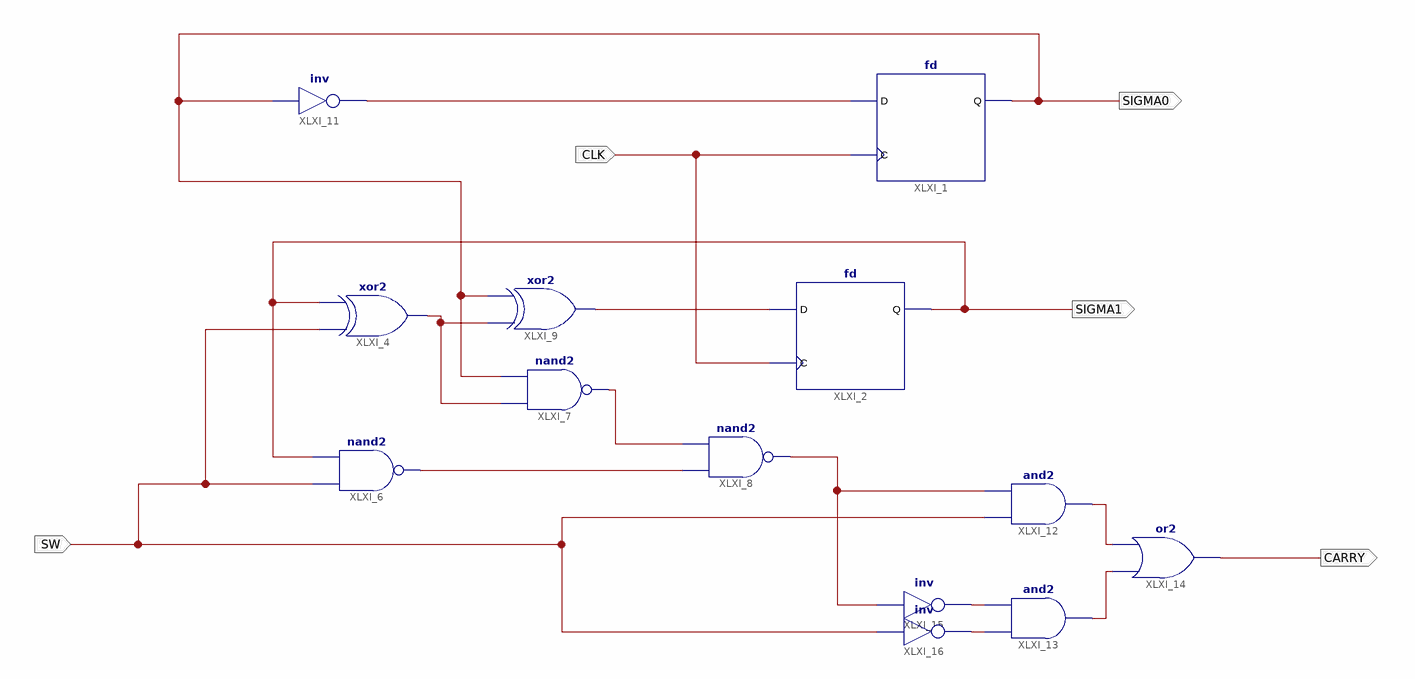
[diagram p0: schematic sheet 1]
// Xilinx ISE schematic UPDOWN_CNT2_1.sch (spartan6) as structural Verilog: 13 symbols, 5 ports
module UPDOWN_CNT2_1 (
  input  CLK,
  input  SW,
  output SIGMA0,
  output SIGMA1,
  output CARRY
);

  wire XLXN_5, XLXN_9, XLXN_23, XLXN_25, XLXN_26, XLXN_35, XLXN_36, XLXN_37, XLXN_38, XLXN_43;

  fd XLXI_1 (.C(CLK), .D(XLXN_5), .Q(SIGMA0));
  fd XLXI_2 (.C(CLK), .D(XLXN_26), .Q(SIGMA1));
  xor XLXI_4 (XLXN_9, SW, SIGMA1);
  nand XLXI_6 (XLXN_25, SW, SIGMA1);
  nand XLXI_7 (XLXN_23, XLXN_9, SIGMA0);
  nand XLXI_8 (XLXN_38, XLXN_25, XLXN_23);
  xor XLXI_9 (XLXN_26, XLXN_9, SIGMA0);
  not XLXI_11 (XLXN_5, SIGMA0);
  and XLXI_12 (XLXN_35, SW, XLXN_38);
  and XLXI_13 (XLXN_36, XLXN_43, XLXN_37);
  or XLXI_14 (CARRY, XLXN_36, XLXN_35);
  not XLXI_15 (XLXN_37, XLXN_38);
  not XLXI_16 (XLXN_43, SW);
endmodule
